# EAGLE board diyefispic32mz (EAGLE 7.6.0), part 1 of 2
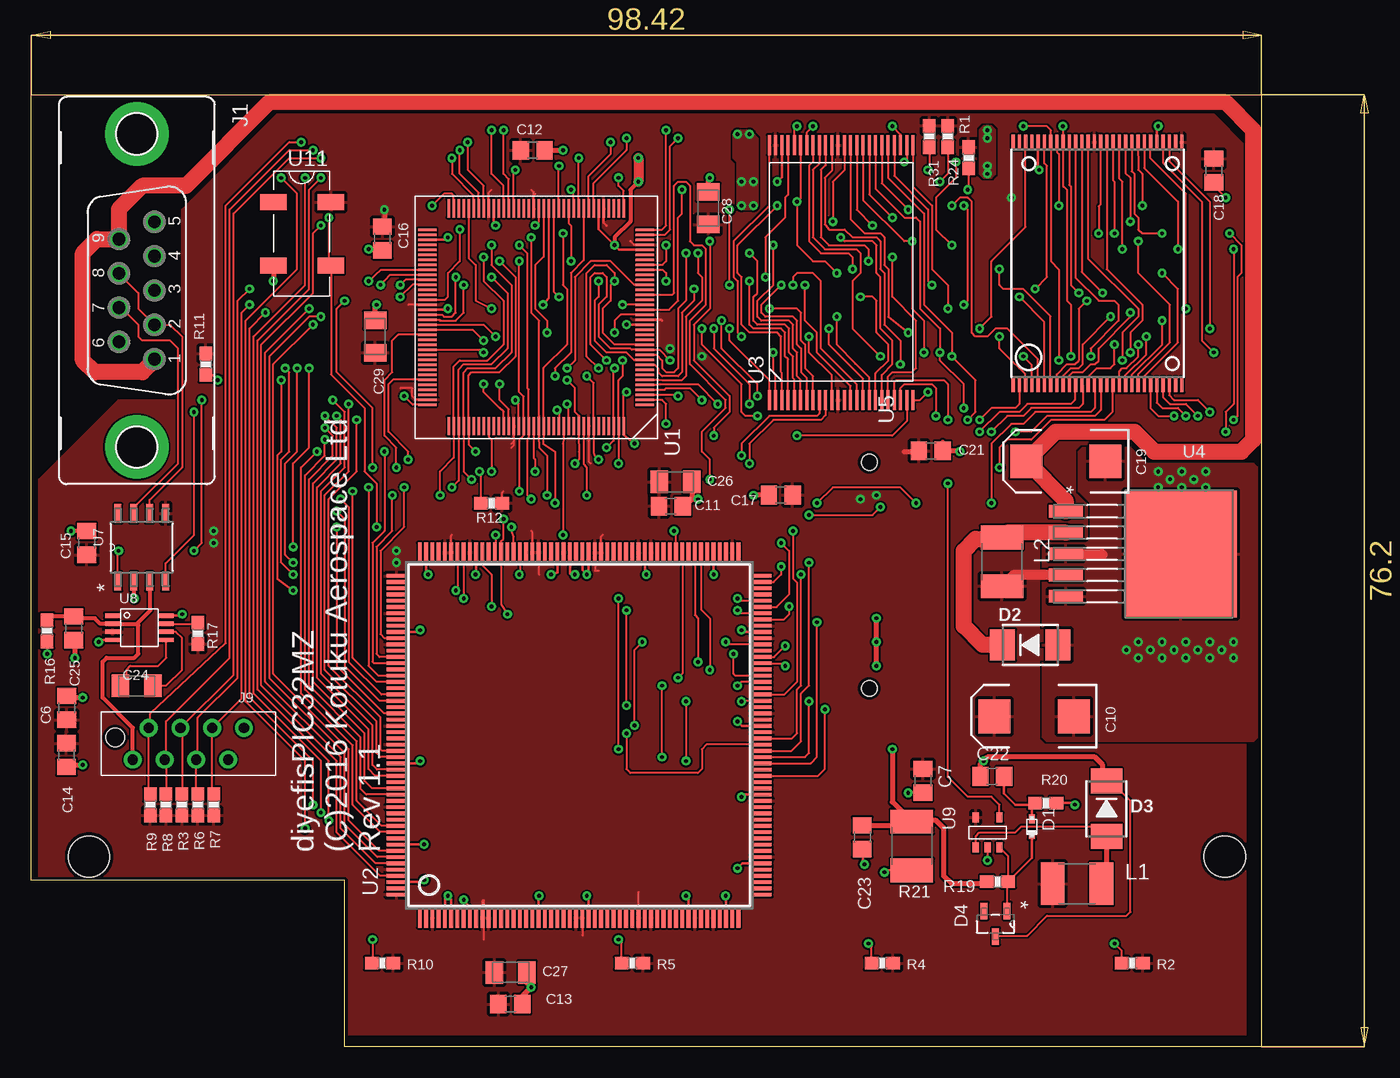
[diagram p2: board, top side]
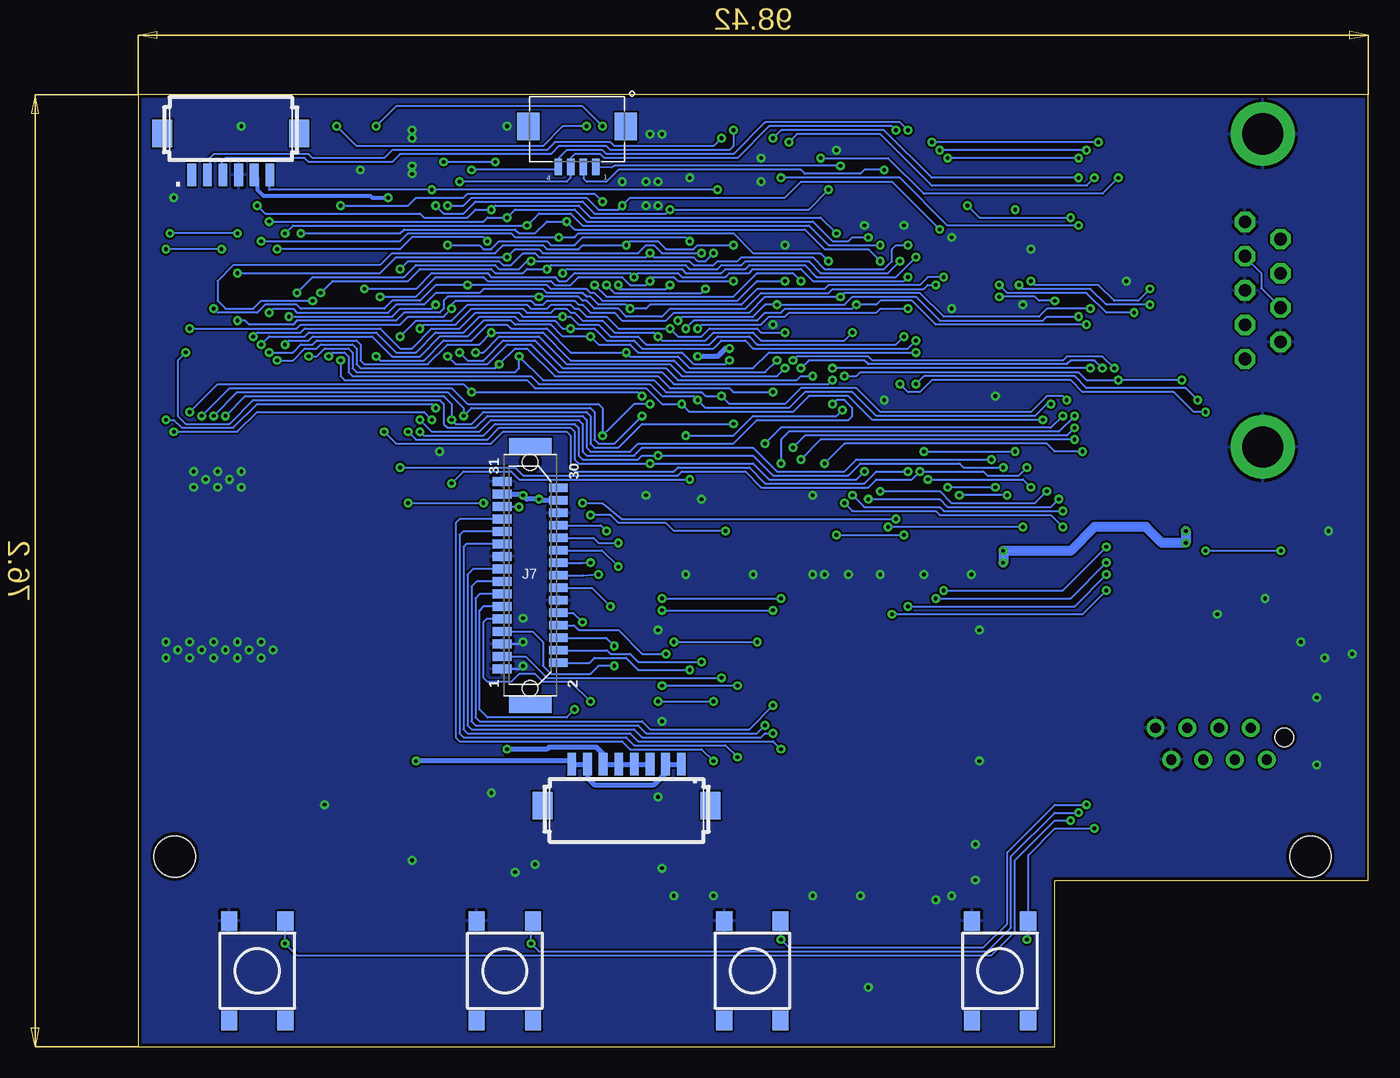
[diagram p3: board, bottom side, seen from below]

Size 98.42 x 76.2 mm. Coordinates in mm from the lower left corner, seen from the top.
Outline: 0,13.33 0,76.2 98.42,76.2 98.42,0 25.08,0 25.08,13.33 0,13.33
Copper layers (1*16): Top 0.035mm / dielectric 1.5mm / Bottom 0.035mm
Design rules "DFRobot_Eagle_Rule_v0.4": minimum track width 6mil, minimum drill 12mil, track to track 6mil, track to pad 6mil, pad to pad 6mil, via to via 6mil, smd to smd 0mil, copper to edge 10mil, drill to drill 10mil, minimum pad ring 12mil, minimum via ring 8mil, stop-mask expansion 2mil, vias tented up to drill 25mil, thermal gap 10mil

## Footprints (pad centres in the part's own frame; a part is rotated, then mirrored left to right if it is on the bottom)
C805 = smd 1.3 x 1.5: 1 -0.95,0; 2 0.95,0
EIA7343 = smd 2.55 x 2.7: A 3.17,0; C -3.17,0
SMC_A = smd 1.4 x 1.8: + -1.3,0; - 1.3,0
SOD523 = smd 0.7 x 0.5: A 0.67,0; C -0.6,0
SMA = smd 2 x 2.5: A 2.223,0; C -2.223,0
SOT91P240X110-3N = smd 1.321 x 0.559: 1 -1.016,0.914; 2 -1.016,-0.914; 3 1.016,0
F09VP = drill 1.016 octagon: 1 5.486,1.422; 2 2.743,1.422; 3 0,1.422; 4 -2.743,1.422; 5 -5.486,1.422; 6 4.115,-1.422; 7 1.372,-1.422; 8 -1.372,-1.422; 9 -4.115,-1.422 | drill 3.302 pad 5.08: G1 -12.522,0; G2 12.522,0
DF13A-8P-1.25H = smd 1.6 x 2.2: M$0 -6.725,2.4; M$1 6.725,2.4 | smd 0.7 x 1.8: P$1 -4.375,-0.9; P$2 -3.125,-0.9; P$3 -1.875,-0.9; P$4 -0.625,-0.9; P$5 0.625,-0.9; P$6 1.875,-0.9; P$7 3.125,-0.9; P$8 4.375,-0.9
XF3M(1)-0415-1B = smd 0.6 x 1.3: 1 -1.5,0.85; 2 -0.5,0.85; 3 0.5,0.85; 4 1.5,0.85 | smd 1.8 x 2.2: M$0 -3.9,-2.4; M$1 3.9,-2.4
DF9-31S = smd 0.7 x 1.5: 1 -7.5,2.25; 2 -7,-2.25; 3 -6.5,2.25; 4 -6,-2.25; 5 -5.5,2.25; 6 -5,-2.25; 7 -4.5,2.25; 8 -4,-2.25; 9 -3.5,2.25; 10 -3,-2.25; 11 -2.5,2.25; 12 -2,-2.25; 13 -1.5,2.25; 14 -1,-2.25; 15 -0.5,2.25; 16 0,-2.25; 17 0.5,2.25; 18 1,-2.25; 19 1.5,2.25; 20 2,-2.25; 21 2.5,2.25; 22 3,-2.25; 23 3.5,2.25; 24 4,-2.25; 25 4.5,2.25; 26 5,-2.25; 27 5.5,2.25; 28 6,-2.25; 29 6.5,2.25; 30 7,-2.25; 31 7.5,2.25 | smd 1.3 x 3.4: M1 -10.35,0; M2 10.35,0 | hole 1.27: 9.05,0; -9.05,0
MTOP-8 = drill 0.813: 1 4.445,1.27; 2 3.175,-1.27; 3 1.905,1.27; 4 0.635,-1.27; 5 -0.635,1.27; 6 -1.905,-1.27; 7 -3.175,1.27; 8 -4.445,-1.27 | hole 1.5: -5.842,0.508
1812 = smd 1.9 x 3.4: 1 -1.95,0; 2 1.95,0
0603-RES = smd 1.1 x 1: 1 -0.85,0; 2 0.85,0
TACTILE_SWITCH_TALL = smd 1.55 x 1.3: A1 -3.975,-2.25; A2 3.975,-2.25; B1 -3.975,2.25; B2 3.975,2.25
STAND-OFF = hole 3.302: 0,0
TQFP-144 = smd 0.2 x 1.45: 1 1.7,0; 2 2.1,0; 3 2.5,0; 4 2.9,0; 5 3.3,0; 6 3.7,0; 7 4.1,0; 8 4.5,0; 9 4.9,0; 10 5.3,0; 11 5.7,0; 12 6.1,0; 13 6.5,0; 14 6.9,0; 15 7.3,0; 16 7.7,0; 17 8.1,0; 18 8.5,0; 19 8.9,0; 20 9.3,0; 21 9.7,0; 22 10.1,0; 23 10.5,0; 24 10.9,0; 25 11.3,0; 26 11.7,0; 27 12.1,0; 28 12.5,0; 29 12.9,0; 30 13.3,0; 31 13.7,0; 32 14.1,0; 33 14.5,0; 34 14.9,0; 35 15.3,0; 36 15.7,0; 73 15.7,17.4; 74 15.3,17.4; 75 14.9,17.4; 76 14.5,17.4; 77 14.1,17.4; 78 13.7,17.4; 79 13.3,17.4; 80 12.9,17.4; 81 12.5,17.4; 82 12.1,17.4; 83 11.7,17.4; 84 11.3,17.4; 85 10.9,17.4; 86 10.5,17.4; 87 10.1,17.4; 88 9.7,17.4; 89 9.3,17.4; 90 8.9,17.4; 91 8.5,17.4; 92 8.1,17.4; 93 7.7,17.4; 94 7.3,17.4; 95 6.9,17.4; 96 6.5,17.4; 97 6.1,17.4; 98 5.7,17.4; 99 5.3,17.4; 100 4.9,17.4; 101 4.5,17.4; 102 4.1,17.4; 103 3.7,17.4; 104 3.3,17.4; 105 2.9,17.4; 106 2.5,17.4; 107 2.1,17.4; 108 1.7,17.4 | smd 1.45 x 0.2: 37 17.4,1.7; 38 17.4,2.1; 39 17.4,2.5; 40 17.4,2.9; 41 17.4,3.3; 42 17.4,3.7; 43 17.4,4.1; 44 17.4,4.5; 45 17.4,4.9; 46 17.4,5.3; 47 17.4,5.7; 48 17.4,6.1; 49 17.4,6.5; 50 17.4,6.9; 51 17.4,7.3; 52 17.4,7.7; 53 17.4,8.1; 54 17.4,8.5; 55 17.4,8.9; 56 17.4,9.3; 57 17.4,9.7; 58 17.4,10.1; 59 17.4,10.5; 60 17.4,10.9; 61 17.4,11.3; 62 17.4,11.7; 63 17.4,12.1; 64 17.4,12.5; 65 17.4,12.9; 66 17.4,13.3; 67 17.4,13.7; 68 17.4,14.1; 69 17.4,14.5; 70 17.4,14.9; 71 17.4,15.3; 72 17.4,15.7; 109 0,15.7; 110 0,15.3; 111 0,14.9; 112 0,14.5; 113 0,14.1; 114 0,13.7; 115 0,13.3; 116 0,12.9; 117 0,12.5; 118 0,12.1; 119 0,11.7; 120 0,11.3; 121 0,10.9; 122 0,10.5; 123 0,10.1; 124 0,9.7; 125 0,9.3; 126 0,8.9; 127 0,8.5; 128 0,8.1; 129 0,7.7; 130 0,7.3; 131 0,6.9; 132 0,6.5; 133 0,6.1; 134 0,5.7; 135 0,5.3; 136 0,4.9; 137 0,4.5; 138 0,4.1; 139 0,3.7; 140 0,3.3; 141 0,2.9; 142 0,2.5; 143 0,2.1; 144 0,1.7
QFP208 = smd 0.3 x 1.6: 1 -12.75,-14.6; 2 -12.25,-14.6; 3 -11.75,-14.6; 4 -11.25,-14.6; 5 -10.75,-14.6; 6 -10.25,-14.6; 7 -9.75,-14.6; 8 -9.25,-14.6; 9 -8.75,-14.6; 10 -8.25,-14.6; 11 -7.75,-14.6; 12 -7.25,-14.6; 13 -6.75,-14.6; 14 -6.25,-14.6; 15 -5.75,-14.6; 16 -5.25,-14.6; 17 -4.75,-14.6; 18 -4.25,-14.6; 19 -3.75,-14.6; 20 -3.25,-14.6; 21 -2.75,-14.6; 22 -2.25,-14.6; 23 -1.75,-14.6; 24 -1.25,-14.6; 25 -0.75,-14.6; 26 -0.25,-14.6; 27 0.25,-14.6; 28 0.75,-14.6; 29 1.25,-14.6; 30 1.75,-14.6; 31 2.25,-14.6; 32 2.75,-14.6; 33 3.25,-14.6; 34 3.75,-14.6; 35 4.25,-14.6; 36 4.75,-14.6; 37 5.25,-14.6; 38 5.75,-14.6; 39 6.25,-14.6; 40 6.75,-14.6; 41 7.25,-14.6; 42 7.75,-14.6; 43 8.25,-14.6; 44 8.75,-14.6; 45 9.25,-14.6; 46 9.75,-14.6; 47 10.25,-14.6; 48 10.75,-14.6; 49 11.25,-14.6; 50 11.75,-14.6; 51 12.25,-14.6; 52 12.75,-14.6; 105 12.75,14.6; 106 12.25,14.6; 107 11.75,14.6; 108 11.25,14.6; 109 10.75,14.6; 110 10.25,14.6; 111 9.75,14.6; 112 9.25,14.6; 113 8.75,14.6; 114 8.25,14.6; 115 7.75,14.6; 116 7.25,14.6; 117 6.75,14.6; 118 6.25,14.6; 119 5.75,14.6; 120 5.25,14.6; 121 4.75,14.6; 122 4.25,14.6; 123 3.75,14.6; 124 3.25,14.6; 125 2.75,14.6; 126 2.25,14.6; 127 1.75,14.6; 128 1.25,14.6; 129 0.75,14.6; 130 0.25,14.6; 131 -0.25,14.6; 132 -0.75,14.6; 133 -1.25,14.6; 134 -1.75,14.6; 135 -2.25,14.6; 136 -2.75,14.6; 137 -3.25,14.6; 138 -3.75,14.6; 139 -4.25,14.6; 140 -4.75,14.6; 141 -5.25,14.6; 142 -5.75,14.6; 143 -6.25,14.6; 144 -6.75,14.6; 145 -7.25,14.6; 146 -7.75,14.6; 147 -8.25,14.6; 148 -8.75,14.6; 149 -9.25,14.6; 150 -9.75,14.6; 151 -10.25,14.6; 152 -10.75,14.6; 153 -11.25,14.6; 154 -11.75,14.6; 155 -12.25,14.6; 156 -12.75,14.6 | smd 1.6 x 0.3: 53 14.6,-12.75; 54 14.6,-12.25; 55 14.6,-11.75; 56 14.6,-11.25; 57 14.6,-10.75; 58 14.6,-10.25; 59 14.6,-9.75; 60 14.6,-9.25; 61 14.6,-8.75; 62 14.6,-8.25; 63 14.6,-7.75; 64 14.6,-7.25; 65 14.6,-6.75; 66 14.6,-6.25; 67 14.6,-5.75; 68 14.6,-5.25; 69 14.6,-4.75; 70 14.6,-4.25; 71 14.6,-3.75; 72 14.6,-3.25; 73 14.6,-2.75; 74 14.6,-2.25; 75 14.6,-1.75; 76 14.6,-1.25; 77 14.6,-0.75; 78 14.6,-0.25; 79 14.6,0.25; 80 14.6,0.75; 81 14.6,1.25; 82 14.6,1.75; 83 14.6,2.25; 84 14.6,2.75; 85 14.6,3.25; 86 14.6,3.75; 87 14.6,4.25; 88 14.6,4.75; 89 14.6,5.25; 90 14.6,5.75; 91 14.6,6.25; 92 14.6,6.75; 93 14.6,7.25; 94 14.6,7.75; 95 14.6,8.25; 96 14.6,8.75; 97 14.6,9.25; 98 14.6,9.75; 99 14.6,10.25; 100 14.6,10.75; 101 14.6,11.25; 102 14.6,11.75; 103 14.6,12.25; 104 14.6,12.75; 157 -14.6,12.75; 158 -14.6,12.25; 159 -14.6,11.75; 160 -14.6,11.25; 161 -14.6,10.75; 162 -14.6,10.25; 163 -14.6,9.75; 164 -14.6,9.25; 165 -14.6,8.75; 166 -14.6,8.25; 167 -14.6,7.75; 168 -14.6,7.25; 169 -14.6,6.75; 170 -14.6,6.25; 171 -14.6,5.75; 172 -14.6,5.25; 173 -14.6,4.75; 174 -14.6,4.25; 175 -14.6,3.75; 176 -14.6,3.25; 177 -14.6,2.75; 178 -14.6,2.25; 179 -14.6,1.75; 180 -14.6,1.25; 181 -14.6,0.75; 182 -14.6,0.25; 183 -14.6,-0.25; 184 -14.6,-0.75; 185 -14.6,-1.25; 186 -14.6,-1.75; 187 -14.6,-2.25; 188 -14.6,-2.75; 189 -14.6,-3.25; 190 -14.6,-3.75; 191 -14.6,-4.25; 192 -14.6,-4.75; 193 -14.6,-5.25; 194 -14.6,-5.75; 195 -14.6,-6.25; 196 -14.6,-6.75; 197 -14.6,-7.25; 198 -14.6,-7.75; 199 -14.6,-8.25; 200 -14.6,-8.75; 201 -14.6,-9.25; 202 -14.6,-9.75; 203 -14.6,-10.25; 204 -14.6,-10.75; 205 -14.6,-11.25; 206 -14.6,-11.75; 207 -14.6,-12.25; 208 -14.6,-12.75
TSOP48 = smd 0.25 x 1.6: 1 0,0; 2 0.5,0; 3 1,0; 4 1.5,0; 5 2,0; 6 2.5,0; 7 3,0; 8 3.5,0; 9 4,0; 10 4.5,0; 11 5,0; 12 5.5,0; 13 6,0; 14 6.5,0; 15 7,0; 16 7.5,0; 17 8,0; 18 8.5,0; 19 9,0; 20 9.5,0; 21 10,0; 22 10.5,0; 23 11,0; 24 11.5,0; 25 11.5,20.4; 26 11,20.4; 27 10.5,20.4; 28 10,20.4; 29 9.5,20.4; 30 9,20.4; 31 8.5,20.4; 32 8,20.4; 33 7.5,20.4; 34 7,20.4; 35 6.5,20.4; 36 6,20.4; 37 5.5,20.4; 38 5,20.4; 39 4.5,20.4; 40 4,20.4; 41 3.5,20.4; 42 3,20.4; 43 2.5,20.4; 44 2,20.4; 45 1.5,20.4; 46 1,20.4; 47 0.5,20.4; 48 0,20.4
TO170P1435X457-5N = smd 1.016 x 2.692: 1 -3.404,-9.042; 2 -1.702,-9.042; 3 0,-9.042; 4 1.702,-9.042; 5 3.404,-9.042 | smd 10.16 x 8.941: 6 0,0.152
TSOP-56 = smd 0.25 x 1.2: 1 -0.019,-0.048; 2 0.481,-0.048; 3 0.981,-0.048; 4 1.481,-0.048; 5 1.981,-0.048; 6 2.481,-0.048; 7 2.981,-0.048; 8 3.481,-0.048; 9 3.981,-0.048; 10 4.481,-0.048; 11 4.981,-0.048; 12 5.481,-0.048; 13 5.981,-0.048; 14 6.481,-0.048; 15 6.981,-0.048; 16 7.481,-0.048; 17 7.981,-0.048; 18 8.481,-0.048; 19 8.981,-0.048; 20 9.481,-0.048; 21 9.981,-0.048; 22 10.481,-0.048; 23 10.981,-0.048; 24 11.481,-0.048; 25 11.981,-0.048; 26 12.481,-0.048; 27 12.981,-0.048; 28 13.481,-0.048; 29 13.481,19.352; 30 12.981,19.352; 31 12.481,19.352; 32 11.981,19.352; 33 11.481,19.352; 34 10.981,19.352; 35 10.481,19.352; 36 9.981,19.352; 37 9.481,19.352; 38 8.981,19.352; 39 8.481,19.352; 40 7.981,19.352; 41 7.481,19.352; 42 6.981,19.352; 43 6.481,19.352; 44 5.981,19.352; 45 5.481,19.352; 46 4.981,19.352; 47 4.481,19.352; 48 3.981,19.352; 49 3.481,19.352; 50 2.981,19.352; 51 2.481,19.352; 52 1.981,19.352; 53 1.481,19.352; 54 0.981,19.352; 55 0.481,19.352; 56 -0.019,19.352
SOIC127P600X175-8N = smd 1.473 x 0.559: 1 -2.718,1.905; 2 -2.718,0.635; 3 -2.718,-0.635; 4 -2.718,-1.905; 5 2.718,-1.905; 6 2.718,-0.635; 7 2.718,0.635; 8 2.718,1.905
MSOP8 = smd 1.2 x 0.35: 1 -2.145,0.975; 2 -2.145,0.325; 3 -2.145,-0.325; 4 -2.145,-0.975; 5 2.145,-0.975; 6 2.145,-0.325; 7 2.145,0.325; 8 2.145,0.975
SOT-23-5 = smd 0.8 x 0.5: 1 -1.2,0.95; 2 -1.2,0; 3 -1.2,-0.95; 4 1.2,-0.95; 5 1.2,0.95
SG636 = smd 1.3 x 2.1: 1 0,0; 2 5.08,0; 3 5.08,4.6; 4 0,4.6
DF13A-6P-1.25H = smd 1.6 x 2.2: M$0 -5.475,2.4; M$1 5.475,2.4 | smd 0.7 x 1.8: P$1 -3.125,-0.9; P$2 -1.875,-0.9; P$3 -0.625,-0.9; P$4 0.625,-0.9; P$5 1.875,-0.9; P$6 3.125,-0.9

## Placement (x,y rotation side)
C6  100nf  [C805]  2.84,27.12 90 top
C7  100nf  [C805]  71.35,21.28 270 top
C10  220mf  [EIA7343]  80.24,26.43 180 top
C11  100nf  [C805]  51.17,43.25 0 top
C12  100nf  [C805]  40.11,71.73 0 top
C13  100nf  [C805]  38.33,3.41 0 top
C14  100nf  [C805]  2.82,23.34 270 top
C15  100nf  [C805]  4.43,40.32 90 top
C16  100nf  [C805]  28.09,64.68 270 top
C17  100nf  [C805]  59.97,44.14 180 top
C18  100nf  [C805]  94.62,70.11 270 top
C19  220mf 50v  [EIA7343]  82.78,46.85 180 top
C21  100nf  [C805]  71.98,47.68 0 top
C22  2200pf  [C805]  76.89,21.63 0 top
C23  220nf  [C805]  66.5,16.77 270 top
C24  1mf  [SMC_A]  8.44,28.88 180 top
C25  100nf  [C805]  3.39,33.47 270 top
C26  10mf  [SMC_A]  51.55,45.19 0 top
C27  10mf  [SMC_A]  38.37,5.95 0 top
C28  10mf  [SMC_A]  54.17,67.1 90 top
C29  10mf  [SMC_A]  27.53,56.83 90 top
D1  1N4148  [SOD523]  80.06,17.56 90 top
D2  B140-13-F  [SMA]  79.94,32.15 0 top
D3  B140-13-F  [SMA]  86.04,19.05 270 top
D4  BZX84CXX  [SOT91P240X110-3N]  77.15,9.84 270 top
J1  [F09VP]  8.44,60.52 270 top
J2  DF13-8P-1.25H  [DF13A-8P-1.25H]  59.35,21.71 180 bottom
J3  XF3M(1)-0415-1B  [XF3M(1)-0415-1B]  63.3,71.25 180 bottom
J7  DF9-31S  [DF9-31S]  67.05,37.72 90 bottom
J9  [MTOP-8]  12.57,24.24 0 top
L1  10uh  [1812]  83.67,13.04 0 top
L2  33uh  [1812]  77.68,38.81 270 top
R1  10K  [0603-RES]  75,71.13 270 top
R2  100K  [0603-RES]  88.09,6.68 0 top
R3  10K  [0603-RES]  12.07,19.37 90 top
R4  100K  [0603-RES]  68.09,6.68 0 top
R5  100K  [0603-RES]  48.09,6.68 0 top
R6  10K  [0603-RES]  13.34,19.37 90 top
R7  10K  [0603-RES]  14.61,19.37 90 top
R8  10K  [0603-RES]  10.79,19.37 90 top
R9  10K  [0603-RES]  9.53,19.37 90 top
R10  100K  [0603-RES]  28.09,6.68 0 top
R11  100K  [0603-RES]  13.97,54.61 270 top
R12  100K  [0603-RES]  36.83,43.5 180 top
R16  10K  [0603-RES]  1.26,33.28 90 top
R17  10K  [0603-RES]  13.34,33.08 270 top
R19  5K11  [0603-RES]  77.33,13.22 0 top
R20  10K  [0603-RES]  81.18,19.5 180 top
R21  0R604  [1812]  70.46,16.06 90 top
R24  100K  [0603-RES]  73.33,72.84 270 top
R31  100K  [0603-RES]  71.86,72.84 270 top
S1  [TACTILE_SWITCH_TALL]  88.9,6.08 90 bottom
S2  [TACTILE_SWITCH_TALL]  69.09,6.08 90 bottom
S3  [TACTILE_SWITCH_TALL]  49.27,6.08 90 bottom
S4  [TACTILE_SWITCH_TALL]  29.46,6.08 90 bottom
STANDOFF1  STAND-OFF  [STAND-OFF]  4.63,15.23 0 top
STANDOFF2  STAND-OFF  [STAND-OFF]  95.5,15.23 0 top
U1  PIC32MZXXXXEC(E/F/K)144  [TQFP-144]  49.09,49.68 90 top
U2  S1D13L02  [QFP208]  43.84,24.93 0 top
U3  AS6C3216  [TSOP48]  59.05,51.75 0 top
U4  LM2592HVS-3.3  [TO170P1435X457-5N]  91.83,39.44 270 top
U5  S29GL128S  [TSOP-56]  78.58,53.02 0 top
U7  MCP2562-E/SN  [SOIC127P600X175-8N]  8.84,39.96 90 top
U8  MCP1253  [MSOP8]  8.66,33.52 0 top
U9  MIC2287C  [SOT-23-5]  76.52,17.14 90 top
U11  SG636  [SG636]  19.38,67.58 270 top
U$3  DF13-6P-1.25H  [DF13A-6P-1.25H]  91.02,70.68 0 bottom